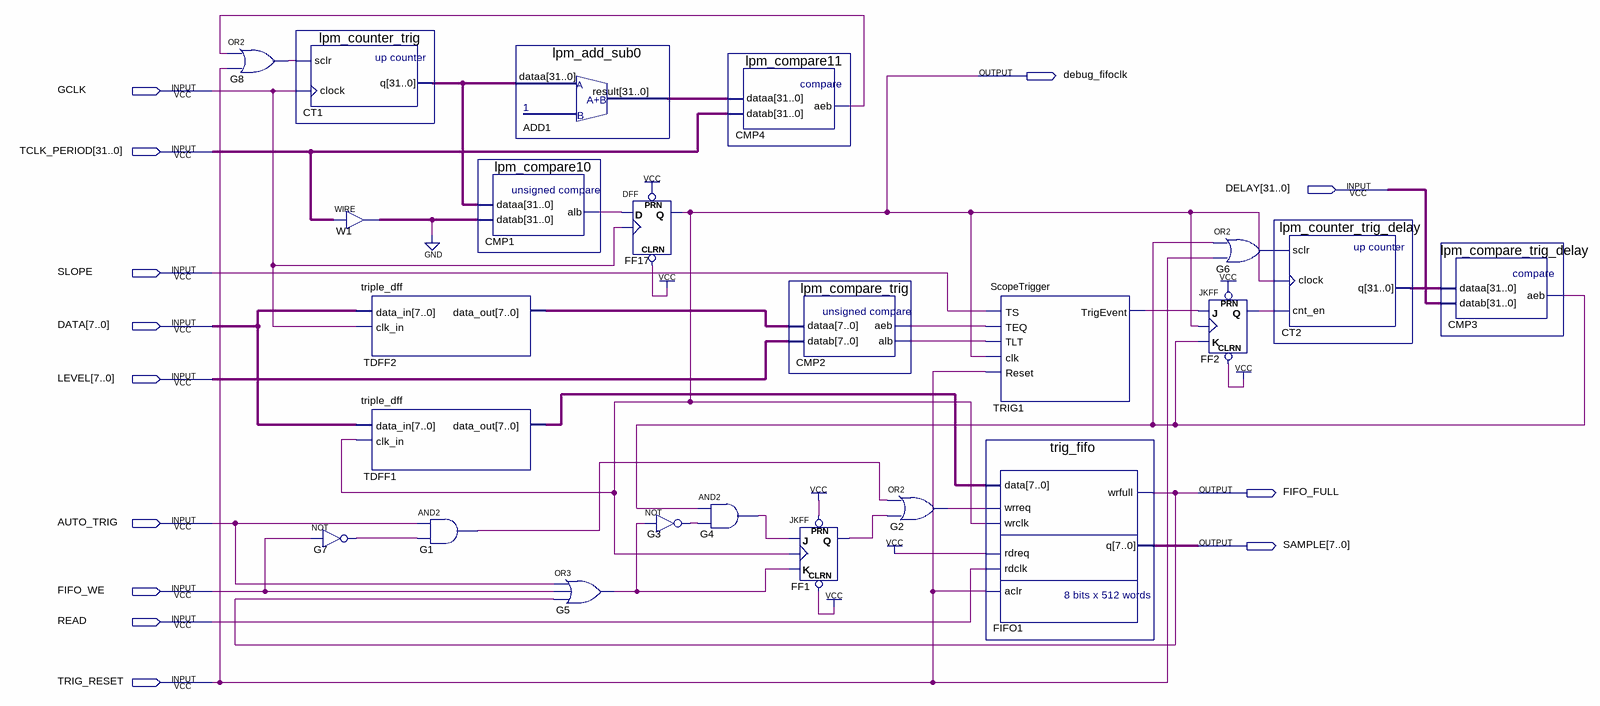
[diagram p0: schematic sheet]
// Quartus schematic triggering_old.bdf as structural Verilog: 23 symbols, 13 pins
module triggering_old (
  input  GCLK,
  input  [31:0] TCLK_PERIOD,
  input  [31:0] DELAY,
  input  SLOPE,
  input  [7:0] DATA,
  input  [7:0] LEVEL,
  input  AUTO_TRIG,
  input  FIFO_WE,
  input  READ,
  input  TRIG_RESET,
  output debug_fifoclk,
  output FIFO_FULL,
  output [7:0] SAMPLE
);

  wire CMP1_alb, CMP2_aeb, CMP2_alb, CMP3_aeb, CMP4_aeb, FF1_q, FF2_q, G1_out, G2_out, G3_out, G4_out,
       G5_out, G6_out, G7_out, G8_out, TRIG1_trigevent;
  wire [7:0] TDFF1_data_out, TDFF2_data_out;
  wire [30:0] div_period;
  wire [31:0] ADD1_result, CT1_q, CT2_q;

  or G8 (G8_out, CMP4_aeb, TRIG_RESET);
  lpm_counter_trig CT1 (.sclr(G8_out), .clock(GCLK), .q(CT1_q));
  not G7 (G7_out, FIFO_WE);
  assign div_period = TCLK_PERIOD[31:1];  // WIRE W1
  triple_dff TDFF2 (.data_in(DATA), .clk_in(GCLK), .data_out(TDFF2_data_out));
  triple_dff TDFF1 (.data_in(DATA), .clk_in(debug_fifoclk), .data_out(TDFF1_data_out));
  and G1 (G1_out, AUTO_TRIG, G7_out);
  lpm_compare10 CMP1 (.dataa(CT1_q), .datab({1'b0, div_period}), .alb(CMP1_alb));
  lpm_add_sub0 ADD1 (.dataa(CT1_q), .result(ADD1_result));
  or G5 (G5_out, AUTO_TRIG, FIFO_WE, FIFO_FULL);
  DFF FF17 (.CLRN(1'b1), .CLK(GCLK), .D(CMP1_alb), .PRN(1'b1), .Q(debug_fifoclk));
  not G3 (G3_out, G5_out);
  lpm_compare11 CMP4 (.dataa(ADD1_result), .datab(TCLK_PERIOD), .aeb(CMP4_aeb));
  and G4 (G4_out, CMP3_aeb, G3_out);
  lpm_compare_trig CMP2 (.dataa(TDFF2_data_out), .datab(LEVEL), .aeb(CMP2_aeb), .alb(CMP2_alb));
  JKFF FF1 (.PRN(1'b1), .CLRN(1'b1), .K(G5_out), .J(G4_out), .CLK(debug_fifoclk), .Q(FF1_q));
  or G2 (G2_out, G1_out, FF1_q);
  ScopeTrigger TRIG1 (
    .TS(SLOPE), .TEQ(CMP2_aeb), .TLT(CMP2_alb), .clk(debug_fifoclk), .Reset(TRIG_RESET),
    .TrigEvent(TRIG1_trigevent));
  trig_fifo FIFO1 (
    .data(TDFF1_data_out), .wrreq(G2_out), .wrclk(debug_fifoclk), .rdreq(1'b1), .rdclk(READ),
    .aclr(TRIG_RESET), .wrfull(FIFO_FULL), .q(SAMPLE));
  or G6 (G6_out, CMP3_aeb, TRIG_RESET);
  JKFF FF2 (.PRN(1'b1), .CLRN(1'b1), .K(CMP3_aeb), .J(TRIG1_trigevent), .CLK(debug_fifoclk), .Q(FF2_q));
  lpm_counter_trig_delay CT2 (.sclr(G6_out), .clock(debug_fifoclk), .cnt_en(FF2_q), .q(CT2_q));
  lpm_compare_trig_delay CMP3 (.dataa(CT2_q), .datab(DELAY), .aeb(CMP3_aeb));

  // Other names for the same wires on the sheet: clk_period[31:0] = TCLK_PERIOD
endmodule
